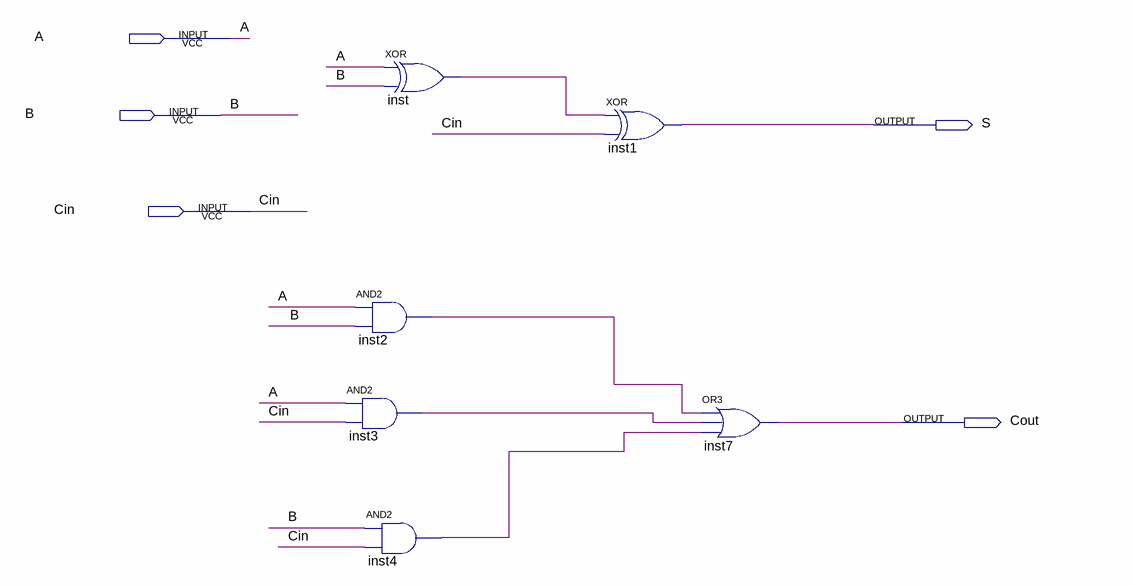
[diagram p0: schematic sheet]
// Quartus schematic Somador.bdf as structural Verilog: 6 symbols, 5 pins
module Somador (
  input  A,
  input  B,
  input  Cin,
  output S,
  output Cout
);

  wire inst2_out, inst3_out, inst4_out, inst_out;

  and inst2 (inst2_out, A, B);
  and inst3 (inst3_out, A, Cin);
  and inst4 (inst4_out, B, Cin);
  xor inst (inst_out, A, B);
  xor inst1 (S, inst_out, Cin);
  or inst7 (Cout, inst2_out, inst3_out, inst4_out);
endmodule
